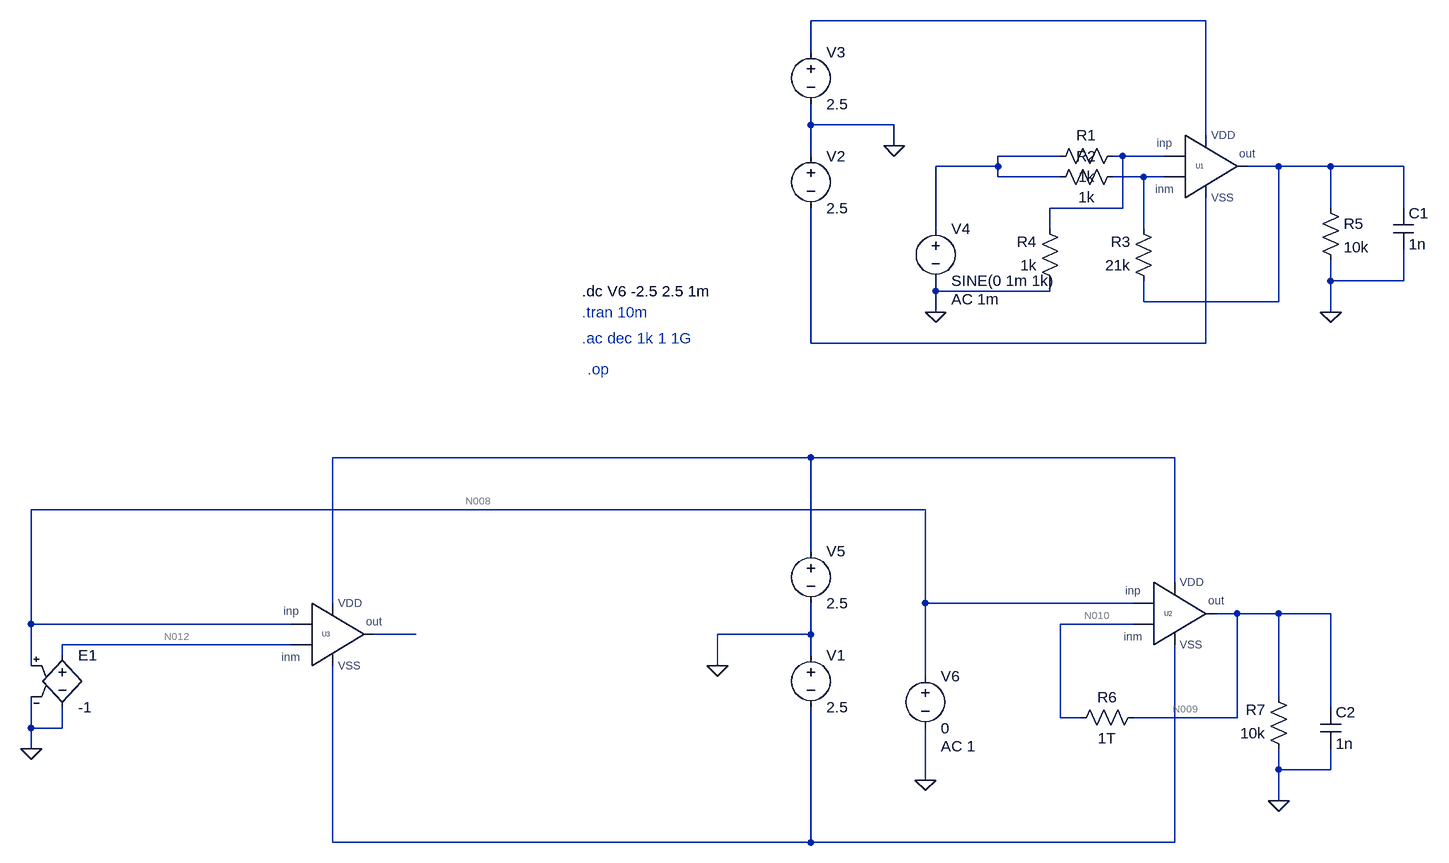
[diagram p0: schematic Draft1.asc]
Draft1.asc, the LTspice schematic file:
Version 4
SHEET 1 1304 1224
WIRE 960 -48 352 -48
WIRE 352 0 352 -48
WIRE 352 112 352 80
WIRE 480 112 352 112
WIRE 960 128 960 -48
WIRE 480 144 480 112
WIRE 352 160 352 112
WIRE 736 160 640 160
WIRE 832 160 816 160
WIRE 896 160 832 160
WIRE 640 176 640 160
WIRE 640 176 544 176
WIRE 1072 176 1024 176
WIRE 1152 176 1072 176
WIRE 1264 176 1152 176
WIRE 640 192 640 176
WIRE 736 192 640 192
WIRE 864 192 816 192
WIRE 896 192 864 192
WIRE 832 240 832 160
WIRE 832 240 720 240
WIRE 1152 240 1152 176
WIRE 1264 240 1264 176
WIRE 544 272 544 176
WIRE 720 272 720 240
WIRE 864 272 864 192
WIRE 1152 352 1152 320
WIRE 1264 352 1264 304
WIRE 1264 352 1152 352
WIRE 544 368 544 352
WIRE 720 368 720 352
WIRE 720 368 544 368
WIRE 864 384 864 352
WIRE 1072 384 1072 176
WIRE 1072 384 864 384
WIRE 544 400 544 368
WIRE 1152 400 1152 352
WIRE 352 448 352 240
WIRE 960 448 960 224
WIRE 960 448 352 448
WIRE 352 624 -384 624
WIRE 912 624 352 624
WIRE 528 704 -848 704
WIRE 352 768 352 624
WIRE 912 816 912 624
WIRE -384 848 -384 624
WIRE 528 848 528 704
WIRE 848 848 528 848
WIRE 1008 864 976 864
WIRE 1072 864 1008 864
WIRE 1152 864 1072 864
WIRE -848 880 -848 704
WIRE -448 880 -848 880
WIRE 848 880 736 880
WIRE -256 896 -320 896
WIRE 352 896 352 848
WIRE 352 896 208 896
WIRE -448 912 -800 912
WIRE -800 928 -800 912
WIRE 352 928 352 896
WIRE -848 944 -848 880
WIRE 208 944 208 896
WIRE 528 960 528 848
WIRE 1072 992 1072 864
WIRE 1152 1008 1152 864
WIRE 736 1024 736 880
WIRE 768 1024 736 1024
WIRE 1008 1024 1008 864
WIRE 1008 1024 848 1024
WIRE -848 1040 -848 992
WIRE -800 1040 -800 1008
WIRE -800 1040 -848 1040
WIRE -848 1072 -848 1040
WIRE 1072 1104 1072 1072
WIRE 1152 1104 1152 1072
WIRE 1152 1104 1072 1104
WIRE 528 1120 528 1040
WIRE 1072 1152 1072 1104
WIRE -384 1216 -384 944
WIRE 352 1216 352 1008
WIRE 352 1216 -384 1216
WIRE 912 1216 912 912
WIRE 912 1216 352 1216
FLAG 480 144 0
FLAG 544 400 0
FLAG 1152 400 0
FLAG 208 944 0
FLAG 1072 1152 0
FLAG 528 1120 0
FLAG -848 1072 0
DATAFLAG 1184 176 ""
SYMBOL voltage 352 144 R0
SYMATTR InstName V2
SYMATTR Value 2.5
SYMBOL voltage 352 -16 R0
SYMATTR InstName V3
SYMATTR Value 2.5
SYMBOL res 832 144 R90
WINDOW 0 0 56 VBottom 2
WINDOW 3 32 56 VTop 2
SYMATTR InstName R1
SYMATTR Value 1k
SYMBOL res 832 176 R90
WINDOW 0 0 56 VBottom 2
WINDOW 3 32 56 VTop 2
SYMATTR InstName R2
SYMATTR Value 1k
SYMBOL res 880 368 R180
WINDOW 0 36 76 Left 2
WINDOW 3 36 40 Left 2
SYMATTR InstName R3
SYMATTR Value 21k
SYMBOL voltage 544 256 R0
WINDOW 123 24 124 Left 2
WINDOW 39 0 0 Left 0
SYMATTR Value2 AC 1m
SYMATTR InstName V4
SYMATTR Value SINE(0 1m 1k)
SYMBOL res 736 368 R180
WINDOW 0 36 76 Left 2
WINDOW 3 36 40 Left 2
SYMATTR InstName R4
SYMATTR Value 1k
SYMBOL res 1136 224 R0
SYMATTR InstName R5
SYMATTR Value 10k
SYMBOL cap 1248 240 R0
SYMATTR InstName C1
SYMATTR Value 1n
SYMBOL voltage 352 912 R0
SYMATTR InstName V1
SYMATTR Value 2.5
SYMBOL voltage 352 752 R0
SYMATTR InstName V5
SYMATTR Value 2.5
SYMBOL voltage 528 944 R0
WINDOW 123 24 124 Left 2
WINDOW 39 0 0 Left 0
SYMATTR Value2 AC 1
SYMATTR InstName V6
SYMATTR Value 0
SYMBOL res 864 1008 R90
WINDOW 0 0 56 VBottom 2
WINDOW 3 32 56 VTop 2
SYMATTR InstName R6
SYMATTR Value 1T
SYMBOL res 1088 1088 R180
WINDOW 0 36 76 Left 2
WINDOW 3 36 40 Left 2
SYMATTR InstName R7
SYMATTR Value 10k
SYMBOL cap 1136 1008 R0
SYMATTR InstName C2
SYMATTR Value 1n
SYMBOL e -800 912 R0
SYMATTR InstName E1
SYMATTR Value -1
SYMBOL opa 960 176 R0
SYMATTR InstName U1
SYMBOL opa 912 864 R0
SYMATTR InstName U2
SYMBOL opa -384 896 R0
SYMATTR InstName U3
TEXT 0 368 Left 2 !.dc V6 -2.5 2.5 1m
TEXT 0 400 Left 2 ;.tran 10m
TEXT 0 440 Left 2 ;.ac dec 1k 1 1G
TEXT 8 488 Left 2 ;.op

The netlist it stands for:
* Draft1.asc
V2 0 N006 2.5
V3 N001 0 2.5
R1 N003 N002 1k
R2 N005 N002 1k
R3 N004 N005 21k
V4 N002 0 SINE(0 1m 1k) AC 1m
R4 0 N003 1k
R5 N004 0 10k
C1 N004 0 1n
V1 0 N013 2.5
V5 N007 0 2.5
V6 N008 0 0 AC 1
R6 N009 N010 1T
R7 0 N009 10k
C2 N009 0 1n
E1 N012 0 N008 0 -1
XU1 N005 N003 N004 N001 N006 opa01  ; pins inm inp out VDD VSS
XU2 N010 N008 N009 N007 N013 opa01  ; pins inm inp out VDD VSS
XU3 N012 N008 N011 N007 N013 opa01  ; pins inm inp out VDD VSS
.dc V6 -2.5 2.5 1m
* .tran 10m
* .ac dec 1k 1 1G
* .op
.lib opa01.lib
.backanno
.end

* Results of the author's LTspice run, read from the files saved beside the schematic
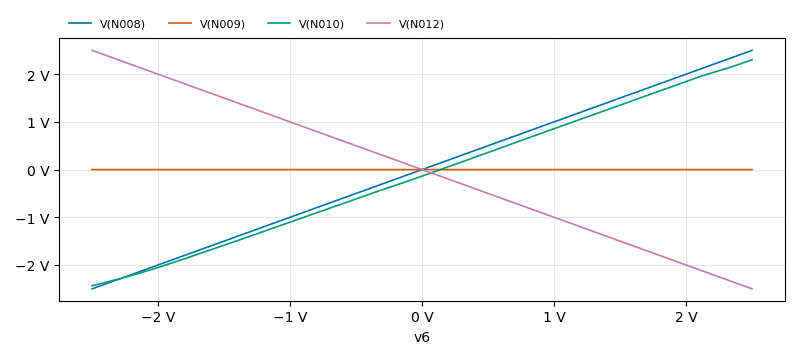
[diagram p1: DC transfer characteristic of Draft1.asc, plotted from the saved traces]
* DC transfer characteristic, 1 run:
*   V(N008): -2.5 V at v6=-2.5 V, 2.5 V at v6=2.5 V, min -2.5 V, max 2.5 V
*   V(N009): -24.35 nV at v6=-2.5 V, 23.04 nV at v6=2.5 V, min -24.35 nV, max 23.04 nV
*   V(N010): -2.435 V at v6=-2.5 V, 2.304 V at v6=2.5 V, min -2.435 V, max 2.304 V
*   V(N012): 2.5 V at v6=-2.5 V, -2.5 V at v6=2.5 V, min -2.5 V, max 2.5 V